# EasyEDA Pro project TI板第四版MPU6050超声波.epro, schematic Schematic1
Board Name: Board1; Create Date: 2026-06-09; Page Name: P1; Project Name: TI板第四版MPU6050超声波; Schematic Name: Schematic1; Update Date: 2026-06-09; Company: 嘉立创EDA; Page Size: A4; Version: V1.0
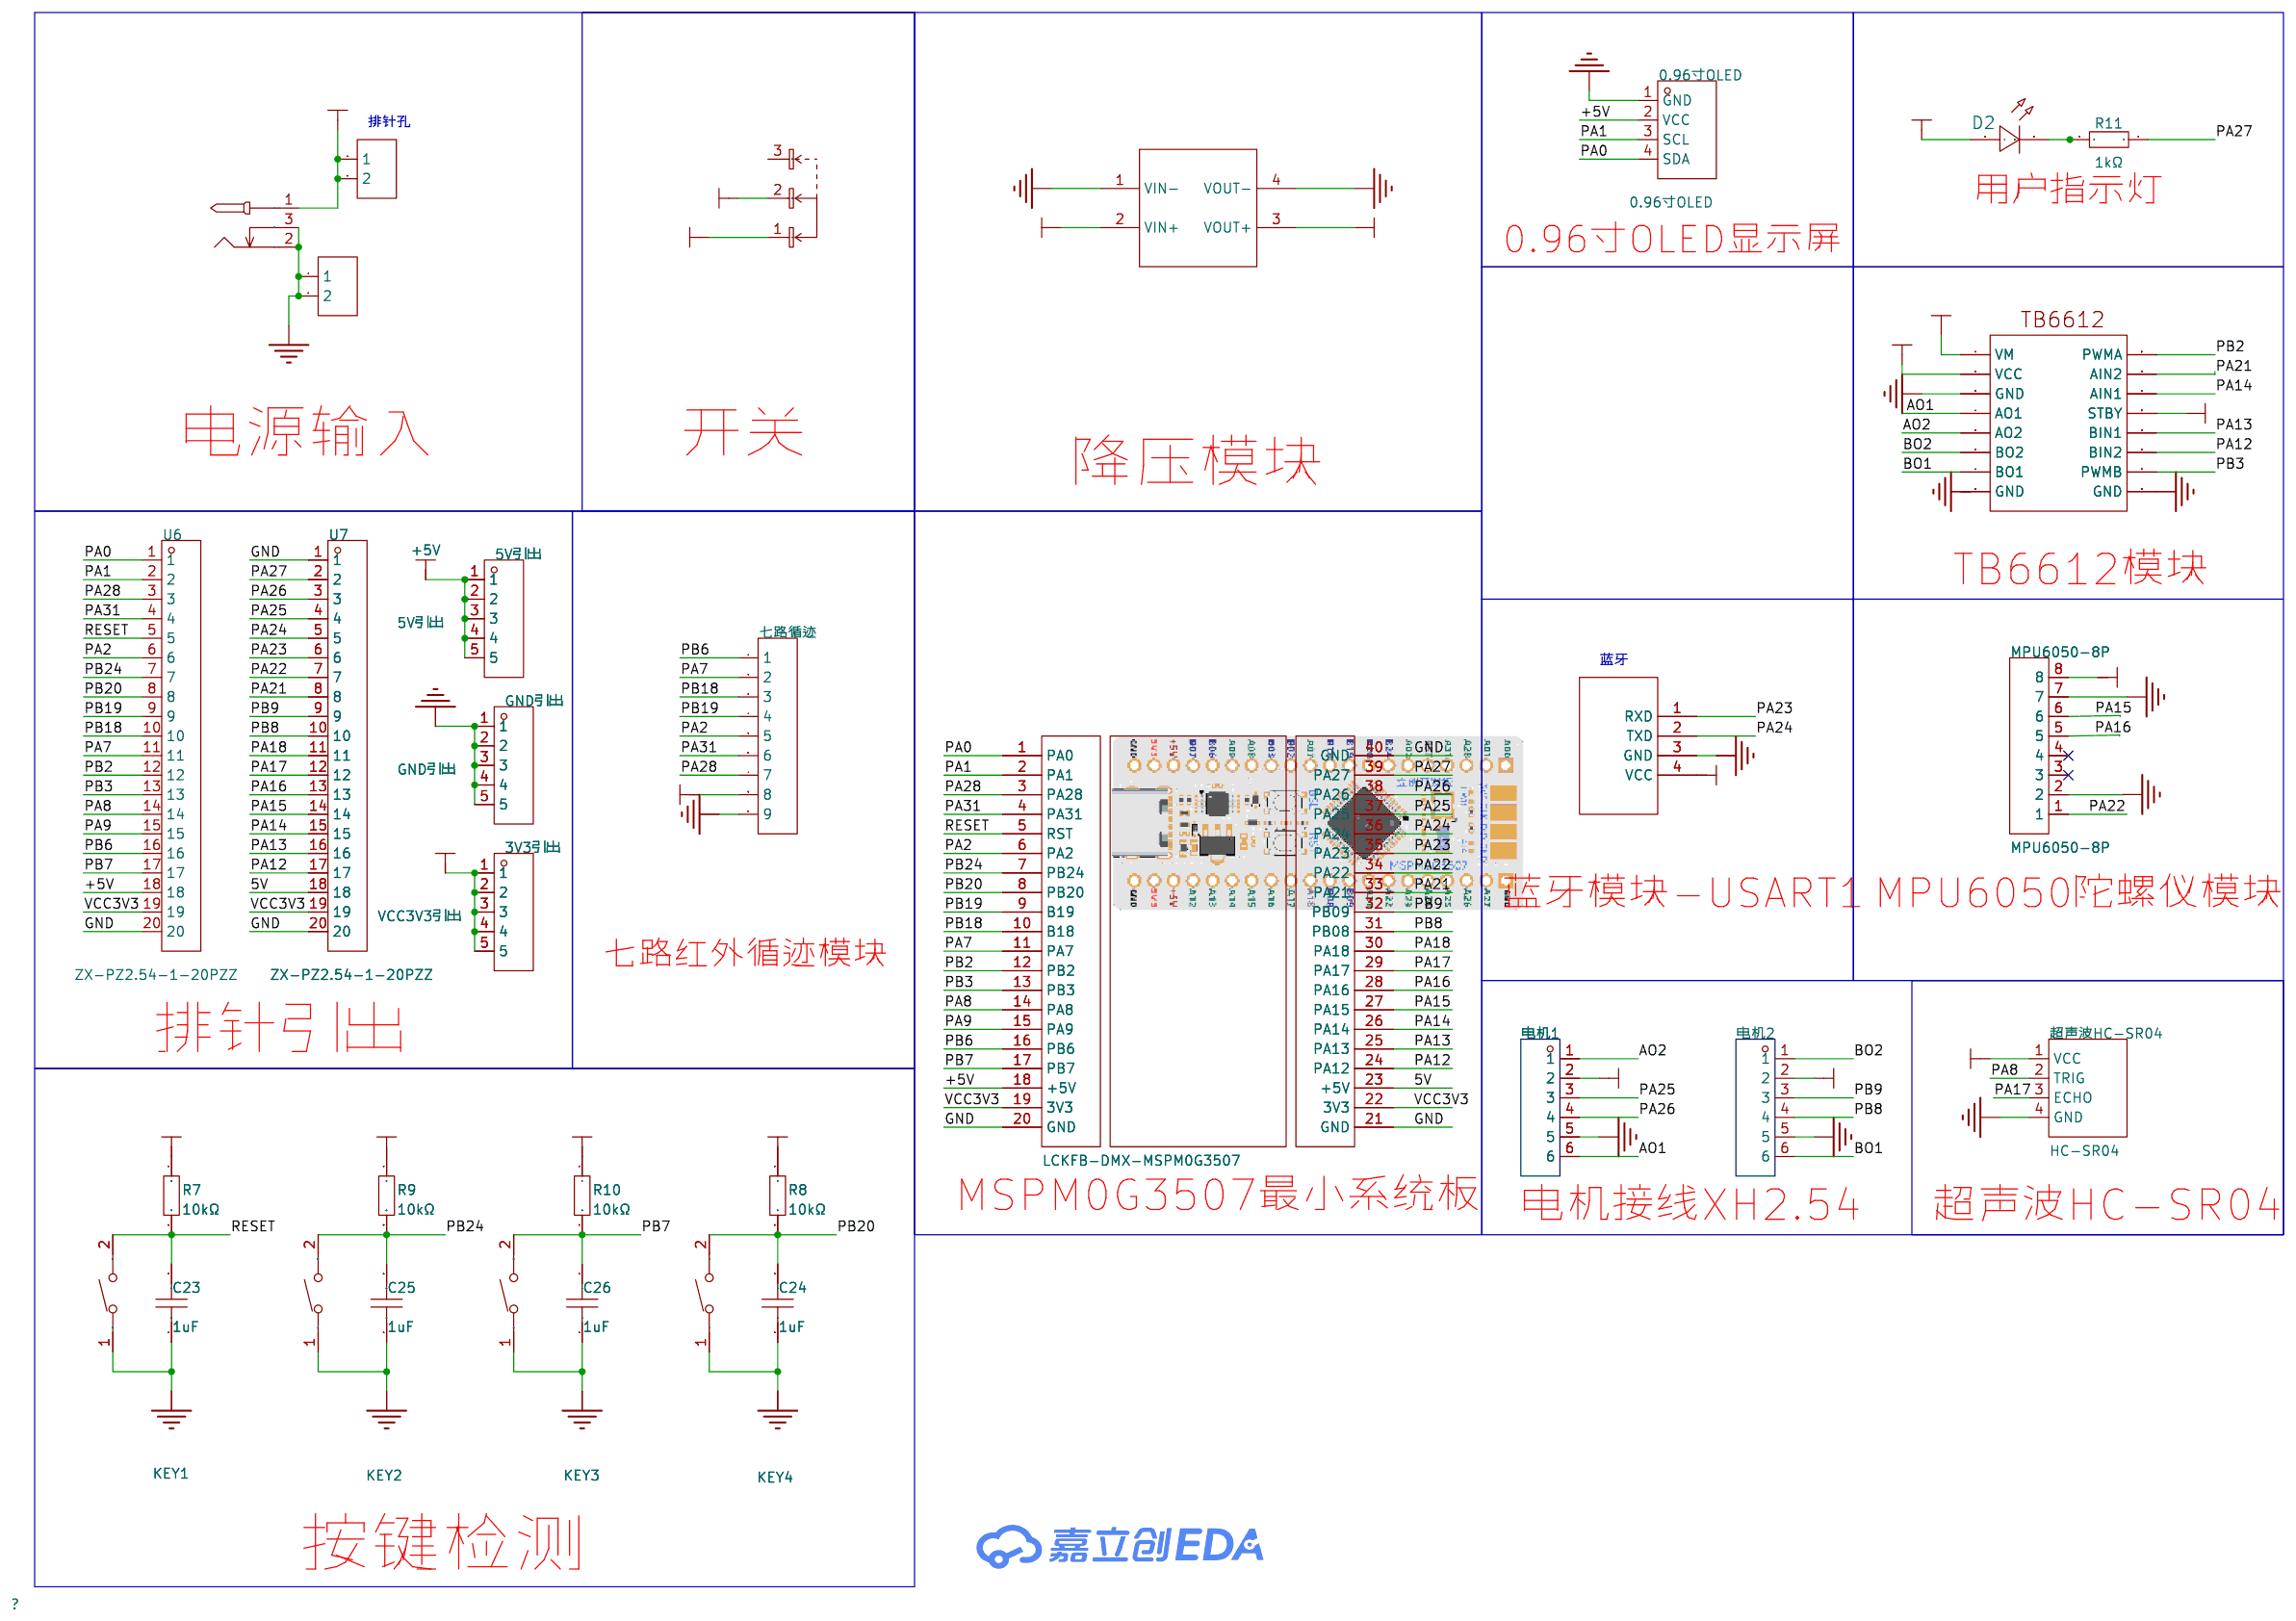
[diagram p0: schematic sheet]

## Parts
0.96寸OLED  0.96寸OLED  [OLED-TH_L27.8-W27.2-P2.54_C9900033791]
3V3引出  VCC3V3引出  [HDR-TH_5P-P2.54-V-M]
5V引出  5V引出  [HDR-TH_5P-P2.54-V-M]
C23  1uF  [C0603]
C24  1uF  [C0603]
C25  1uF  [C0603]
C26  1uF  [C0603]
D2  -  [LED_0603]
DC  -  [DC-005_2.5]
GND  -  [HDR-TH_2P-P2.54-V-F]
GND引出  GND引出  [HDR-TH_5P-P2.54-V-M]
KEY1  KAN0654-0601B  [KEY-TH_L6.0-W6.0-P5.00-LS5.5]
KEY2  KAN0654-0601B  [KEY-TH_L6.0-W6.0-P5.00-LS5.5]
KEY3  KAN0654-0601B  [KEY-TH_L6.0-W6.0-P5.00-LS5.5]
KEY4  KAN0654-0601B  [KEY-TH_L6.0-W6.0-P5.00-LS5.5]
MPU6050-8P  MPU6050-8P  [CONN-TH_8P-P2.54_XH2.54_C9900012080]
MSPM0G3507  LCKFB-DMX-MSPM0G3507  [COMM-TH_L53.3-W22.9-P2.54_LC-DMX-MSPM0G3507]
R7  10kΩ  [R0603]
R8  10kΩ  [R0603]
R9  10kΩ  [R0603]
R10  10kΩ  [R0603]
R11  1kΩ  [R0603]
SW4  SS-12D06L5  [SW-TH_3P-P4.70_L11.1-W12.7]
U6  ZX-PZ2.54-1-20PZZ  [HDR-TH_20P-P2.54-V-M]
U7  ZX-PZ2.54-1-20PZZ  [HDR-TH_20P-P2.54-V-M]
U11  -  [TB6612]
VCC  -  [HDR-TH_2P-P2.54-V-F]
七路循迹  -  [HDR-TH_9P-P2.54-V-F-1]
电机1  -  [ph2.54]
电机2  -  [ph2.54]
蓝牙模块  HC06  [HC06]
超声波HC-SR04  HC-SR04  [TH_HC-SR04V]
降压12转5V  -  [MP1584EN模块_邮票孔]

## Library data of the parts
0.96寸OLED = HS96L03W2C03: 主控芯片:SSD1315;接口类型:I2C;尺寸(inch):0.96;像素分辨率:128x64;; LCSC Part Name: 0.96寸OLED显示屏窄白光IIC; Supplier Part: C5248080; Manufacturer: HS(汉昇); JLCPCB Part Class: 扩展库; Datasheet: https://atta.szlcsc.com/upload/public/pdf/source/20230627/763D01F79A90007632F098068C7C8AD9.pdf; Supplier: LCSC; Main Control Chip: SSD1315; Interface Type: I2C; Size: 0.96; Pixel Resolution: 128x64; Operating Temperature: -40℃~+70℃
3V3引出 5V引出 GND引出 = PZ254V-11-05P: 插针结构:1x5P;间距:2.54mm;行距:-;圆针/方针:方针;安装类型:直插;排数:单排;总PIN位数:5P;额定电流:-;额定电压:-;配合针长度:6mm;塑高:2.5mm;端接针长度:3mm;触头材质:黄铜;触头镀层:-;工作温度范围:-40℃~+105℃;颜色:黑色;; LCSC Part Name: 间距:2.54mm 1x5P 直插 方针; Supplier Part: C492404; Manufacturer: XFCN(兴飞); Supplier Footprint: 插件,P=2.54mm; JLCPCB Part Class: Extended Part; Datasheet: https://atta.szlcsc.com/upload/public/pdf/source/20200309/C492404_E51533260F8710EFF5D4617281164C1D.pdf; Supplier: LCSC; Pin Structure: 1x5P; Pitch: 2.54mm; Circluar Pins/Square Pins: 方针; Mounting Type: 直插; Number of Rows: 单排; Number of Pins: 5P; Length of Mating Pin: 6mm; Insulation Height: 2.5mm; Length of End Connection Pin: 3mm; Contact Material: 黄铜; Operating Temperature Range: -40℃~+105℃; Color: 黑色
C23-C26 = CGA0603X5R105K500JT: 容值:1uF;精度:±10%;额定电压:50V;材质(温度系数):X5R;; LCSC Part Name: 1uF ±10% 50V; Supplier Part: C6119852; Manufacturer: HRE(芯声); Supplier Footprint: 0603; JLCPCB Part Class: Extended Part; Supplier: LCSC; Tolerance: ±10%; Voltage Rated: 50V; Temperature Coefficient: X5R
D2 = LED_0603-R: Supplier Footprint: 0603
DC = DC-005_2.5: Supplier Footprint: 插件
GND VCC = HDR-F_2.54_1x2P: Supplier Part: C49661; Supplier Footprint: 插件
KEY1-KEY4 = KAN0654-0601B: 电路结构:单刀单掷;按钮形状:圆形按钮;安装方式:直插;开关长度:6mm;开关宽度:6mm;触点电流:50mA;额定电压(DC):12V;带灯:-;机械寿命:-;; LCSC Part Name: KAN0654-0601B,中两脚直插; Supplier Part: C231709; Manufacturer: GANGYUAN(港源); Supplier Footprint: 插件; JLCPCB Part Class: 扩展库; Datasheet: https://atta.szlcsc.com/upload/public/pdf/source/20180622/C231710_F729DA926A84236AA44CD00FD421FB5A.pdf; Supplier: LCSC; Circuit: 单刀单掷; Actuator Style: 圆形按钮; Mounting Style: 直插; Switch Length: 6mm; Switch Width: 6mm; Contact Current: 50mA; Voltage Rating (DC): 12V
MPU6050-8P = XH2.54-8PIN: Supplier Part: C9900014929; Supplier Footprint: JP8; JLCPCB Part Class: 扩展库; Supplier: LCSC
MSPM0G3507 = LCKFB-DMX-MSPM0G3507: LCSC Part Name: 立创·地猛星-MSPM0G3507开发板; Supplier Part: C22751549; Manufacturer: 立创开发板; JLCPCB Part Class: 扩展库; Datasheet: https://atta.szlcsc.com/upload/public/pdf/source/20241206/01420CD8BC78AA4DB64404AD0FDD4770.pdf; Supplier: LCSC
R7-R9 R11 = 0603WAF1002T5E: 电阻类型:厚膜电阻;阻值:10kΩ;精度:±1%;功率:100mW;最大工作电压:75V;温度系数:±100ppm/℃;; LCSC Part Name: 厚膜电阻 10kΩ ±1% 100mW; Supplier Part: C25804; Manufacturer: UNI-ROYAL(厚声); Supplier Footprint: 0603; JLCPCB Part Class: Basic Part; Datasheet: https://atta.szlcsc.com/upload/public/pdf/source/20200306/C422600_1E6D84923E4A46A82E41ADD87F860B5C.pdf; Supplier: LCSC; Type: 厚膜电阻; Tolerance: ±1%; Power(Watts): 100mW; Overload Voltage (Max): 75V; Temperature Coefficient: ±100ppm/℃; Operating Temperature Range: -55℃~+155℃
